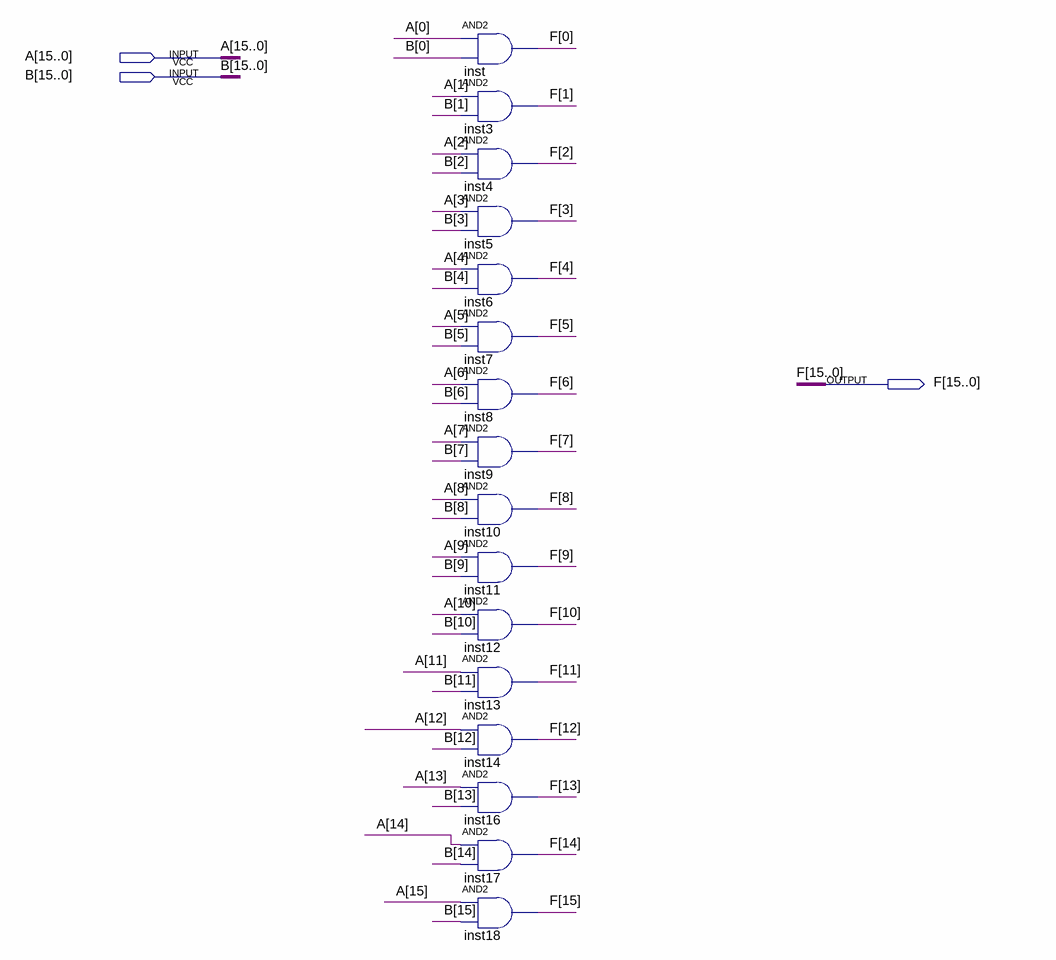
[diagram p0: schematic sheet]
// Quartus schematic 16bitand.bdf as structural Verilog: 16 symbols, 3 pins
module \16bitand  (
  input  [15:0] A,
  input  [15:0] B,
  output [15:0] F
);

  and inst (F[0], A[0], B[0]);
  and inst3 (F[1], A[1], B[1]);
  and inst4 (F[2], A[2], B[2]);
  and inst5 (F[3], A[3], B[3]);
  and inst6 (F[4], A[4], B[4]);
  and inst7 (F[5], A[5], B[5]);
  and inst8 (F[6], A[6], B[6]);
  and inst9 (F[7], A[7], B[7]);
  and inst10 (F[8], A[8], B[8]);
  and inst11 (F[9], A[9], B[9]);
  and inst12 (F[10], A[10], B[10]);
  and inst13 (F[11], A[11], B[11]);
  and inst14 (F[12], A[12], B[12]);
  and inst16 (F[13], A[13], B[13]);
  and inst17 (F[14], A[14], B[14]);
  and inst18 (F[15], A[15], B[15]);
endmodule
